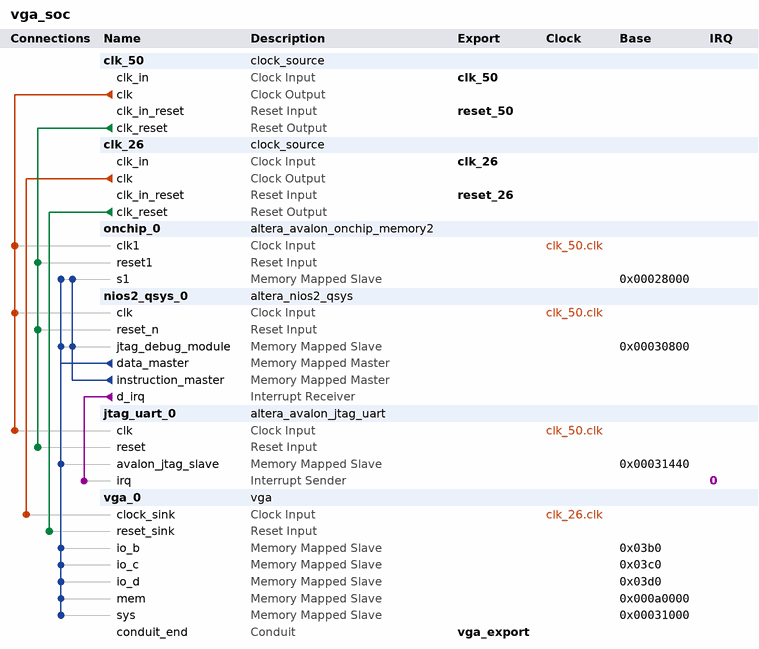
[diagram p0: system contents]
# Platform Designer (Qsys) system vga_soc, Cyclone IV E EP4CE115F29C7
# Parameters at their usual value, and those the tool derives, are not listed.
package require -exact qsys 13.0
create_system vga_soc
set_project_property DEVICE_FAMILY {Cyclone IV E}
set_project_property DEVICE EP4CE115F29C7

add_instance clk_50 clock_source 13.0
set_instance_parameter_value clk_50 clockFrequency 50000000

add_instance clk_26 clock_source 13.0
set_instance_parameter_value clk_26 clockFrequency 26000000

add_instance onchip_0 altera_avalon_onchip_memory2 13.0.1.99.2
set_instance_parameter_value onchip_0 dataWidth 32
set_instance_parameter_value onchip_0 dualPort false
set_instance_parameter_value onchip_0 initMemContent true
set_instance_parameter_value onchip_0 initializationFileName onchip_mem.hex
set_instance_parameter_value onchip_0 memorySize 32768

add_instance nios2_qsys_0 altera_nios2_qsys 13.0
set_instance_parameter_value nios2_qsys_0 resetSlave onchip_0.s1
set_instance_parameter_value nios2_qsys_0 mmu_TLBMissExcSlave None
set_instance_parameter_value nios2_qsys_0 exceptionSlave onchip_0.s1
set_instance_parameter_value nios2_qsys_0 breakSlave nios2_qsys_0.jtag_debug_module
set_instance_parameter_value nios2_qsys_0 impl Tiny
set_instance_parameter_value nios2_qsys_0 icache_size 4096

add_instance jtag_uart_0 altera_avalon_jtag_uart 13.0.1.99.2
set_instance_parameter_value jtag_uart_0 simInteractiveOptions NO_INTERACTIVE_WINDOWS

add_instance vga_0 vga 1.0

# connections
add_connection clk_26.clk vga_0.clock_sink clock
add_connection clk_50.clk jtag_uart_0.clk clock
add_connection clk_50.clk nios2_qsys_0.clk clock
add_connection clk_50.clk onchip_0.clk1 clock
add_connection clk_26.clk_reset vga_0.reset_sink reset
add_connection clk_50.clk_reset jtag_uart_0.reset reset
add_connection clk_50.clk_reset nios2_qsys_0.reset_n reset
add_connection clk_50.clk_reset onchip_0.reset1 reset
add_connection nios2_qsys_0.data_master jtag_uart_0.avalon_jtag_slave avalon
set_connection_parameter_value nios2_qsys_0.data_master/jtag_uart_0.avalon_jtag_slave baseAddress 0x00031440
add_connection nios2_qsys_0.data_master nios2_qsys_0.jtag_debug_module avalon
set_connection_parameter_value nios2_qsys_0.data_master/nios2_qsys_0.jtag_debug_module baseAddress 0x00030800
add_connection nios2_qsys_0.data_master onchip_0.s1 avalon
set_connection_parameter_value nios2_qsys_0.data_master/onchip_0.s1 baseAddress 0x00028000
add_connection nios2_qsys_0.data_master vga_0.io_b avalon
set_connection_parameter_value nios2_qsys_0.data_master/vga_0.io_b baseAddress 0x03b0
add_connection nios2_qsys_0.data_master vga_0.io_c avalon
set_connection_parameter_value nios2_qsys_0.data_master/vga_0.io_c baseAddress 0x03c0
add_connection nios2_qsys_0.data_master vga_0.io_d avalon
set_connection_parameter_value nios2_qsys_0.data_master/vga_0.io_d baseAddress 0x03d0
add_connection nios2_qsys_0.data_master vga_0.mem avalon
set_connection_parameter_value nios2_qsys_0.data_master/vga_0.mem baseAddress 0x000a0000
add_connection nios2_qsys_0.data_master vga_0.sys avalon
set_connection_parameter_value nios2_qsys_0.data_master/vga_0.sys baseAddress 0x00031000
add_connection nios2_qsys_0.instruction_master nios2_qsys_0.jtag_debug_module avalon
set_connection_parameter_value nios2_qsys_0.instruction_master/nios2_qsys_0.jtag_debug_module baseAddress 0x00030800
add_connection nios2_qsys_0.instruction_master onchip_0.s1 avalon
set_connection_parameter_value nios2_qsys_0.instruction_master/onchip_0.s1 baseAddress 0x00028000
add_connection nios2_qsys_0.d_irq jtag_uart_0.irq interrupt
set_connection_parameter_value nios2_qsys_0.d_irq/jtag_uart_0.irq irqNumber 0

# exported interfaces
add_interface clk_50 clock sink
set_interface_property clk_50 EXPORT_OF clk_50.clk_in
add_interface clk_26 clock sink
set_interface_property clk_26 EXPORT_OF clk_26.clk_in
add_interface reset_26 reset sink
set_interface_property reset_26 EXPORT_OF clk_26.clk_in_reset
add_interface vga_export conduit end
set_interface_property vga_export EXPORT_OF vga_0.conduit_end
add_interface reset_50 reset sink
set_interface_property reset_50 EXPORT_OF clk_50.clk_in_reset

set_interconnect_requirement {$system} qsys_mm.clockCrossingAdapter HANDSHAKE
set_interconnect_requirement {$system} qsys_mm.maxAdditionalLatency 1

save_system vga_soc.qsys
